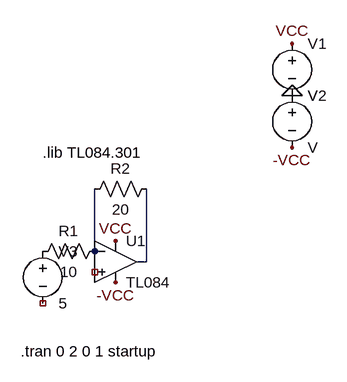
[diagram p0: schematic 1CELDA.asc]
1CELDA.asc, the LTspice schematic file:
Version 4
SHEET 1 880 680
WIRE 96 224 96 128
WIRE 176 240 176 128
WIRE 176 240 160 240
FLAG 128 208 VCC
FLAG 128 272 -VCC
FLAG 400 -96 VCC
FLAG 400 64 -VCC
FLAG 400 -16 0
SYMBOL Opamps\\opamp2 128 176 R0
SYMATTR InstName U1
SYMATTR Value TL084
SYMBOL voltage 400 -112 R0
SYMATTR InstName V1
SYMBOL voltage 400 -32 R0
SYMATTR InstName V2
SYMBOL res 112 208 R90
WINDOW 0 0 56 VBottom 2
WINDOW 3 32 56 VTop 2
SYMATTR InstName R1
SYMATTR Value 10
SYMBOL res 192 112 R90
WINDOW 0 0 56 VBottom 2
WINDOW 3 32 56 VTop 2
SYMATTR InstName R2
SYMATTR Value 20
SYMBOL voltage 16 208 R0
WINDOW 123 0 0 Left 2
WINDOW 39 0 0 Left 2
SYMATTR InstName V3
SYMATTR Value 5
TEXT 16 72 Left 2 !.lib TL084.301
TEXT -18 378 Left 2 !.tran 0 2 0 1 startup

The netlist it stands for:
* 1CELDA.asc
XU1 NC_01 N001 VCC -VCC N002 TL084  ; pins In+ In- V+ V- OUT
V1 VCC 0 V
V2 0 -VCC V
R1 N001 P001 10
R2 N002 N001 20
V3 P001 NC_02 5
.lib TL084.301
.tran 0 2 0 1 startup
.backanno
.end